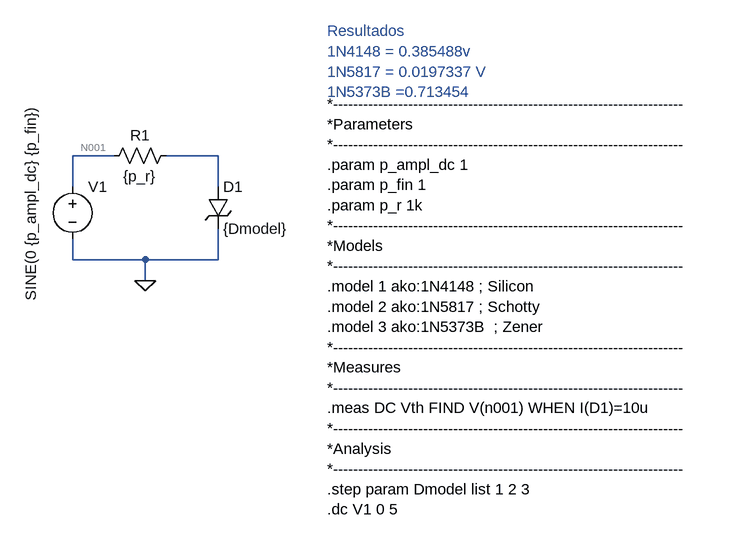
[diagram p0: schematic DIODE_DC.asc]
DIODE_DC.asc, the LTspice schematic file:
Version 4
SHEET 1 1236 680
WIRE 176 32 112 32
WIRE 336 32 256 32
WIRE 112 80 112 32
WIRE 336 80 336 32
WIRE 112 192 112 160
WIRE 224 192 112 192
WIRE 336 192 336 144
WIRE 336 192 224 192
WIRE 224 224 224 192
FLAG 224 224 0
SYMBOL voltage 112 64 R0
WINDOW 3 -64 -111 VRight 2
WINDOW 123 0 0 Left 0
WINDOW 39 0 0 Left 0
SYMATTR Value SINE(0 {p_ampl_dc} {p_fin})
SYMATTR InstName V1
SYMBOL res 272 16 R90
WINDOW 0 0 56 VBottom 2
WINDOW 3 32 56 VTop 2
SYMATTR InstName R1
SYMATTR Value {p_r}
SYMBOL zener 320 80 R0
SYMATTR InstName D1
SYMATTR Value {Dmodel}
SYMATTR Description Diode
SYMATTR Type diode
TEXT 504 -48 Left 2 !*----------------------------------------------------------------------\n*Parameters\n*----------------------------------------------------------------------\n.param p_ampl_dc 1\n.param p_fin 1\n.param p_r 1k\n*----------------------------------------------------------------------\n*Models\n*----------------------------------------------------------------------\n.model 1 ako:1N4148 ; Silicon\n.model 2 ako:1N5817 ; Schotty\n.model 3 ako:1N5373B  ; Zener\n*----------------------------------------------------------------------\n*Measures\n*----------------------------------------------------------------------\n.meas DC Vth FIND V(n001) WHEN I(D1)=10u\n*----------------------------------------------------------------------\n*Analysis\n*----------------------------------------------------------------------\n.step param Dmodel list 1 2 3\n.dc V1 0 5
TEXT 504 -160 Left 2 ;Resultados\n1N4148 = 0.385488v\n1N5817 = 0.0197337 V\n1N5373B =0.713454

The netlist it stands for:
* DIODE_DC.asc
V1 N001 0 SINE(0 {p_ampl_dc} {p_fin})
R1 N002 N001 {p_r}
D1 N002 0 {Dmodel}
.model D D
.lib standard.dio
*----------------------------------------------------------------------
*Parameters
*----------------------------------------------------------------------
.param p_ampl_dc 1
.param p_fin 1
.param p_r 1k
*----------------------------------------------------------------------
*Models
*----------------------------------------------------------------------
.model 1 ako:1N4148 ; Silicon
.model 2 ako:1N5817 ; Schotty
.model 3 ako:1N5373B  ; Zener
*----------------------------------------------------------------------
*Measures
*----------------------------------------------------------------------
.meas DC Vth FIND V(n001) WHEN I(D1)=10u
*----------------------------------------------------------------------
*Analysis
*----------------------------------------------------------------------
.step param Dmodel list 1 2 3
.dc V1 0 5
* Resultados
* 1N4148 = 0.385488v
* 1N5817 = 0.0197337 V
* 1N5373B =0.713454
.backanno
.end

* Results of the author's LTspice run, read from the files saved beside the schematic
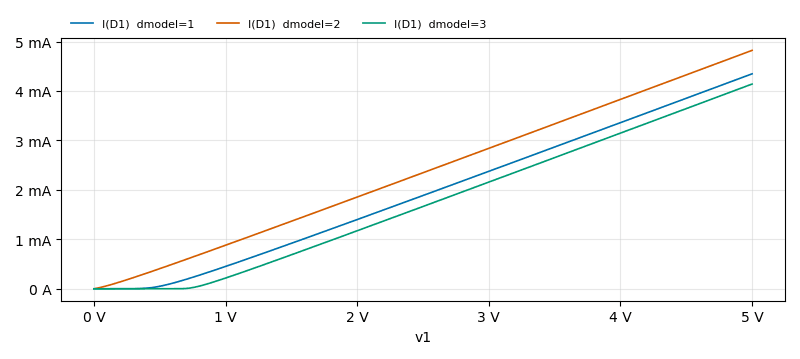
[diagram p1: DC transfer characteristic of DIODE_DC.asc, plotted from the saved traces]
* DC transfer characteristic, 3 runs:
*   I(D1) [dmodel=1]: 0 A at v1=0 V, 4.347 mA at v1=5 V, min 0 A, max 4.347 mA
*   I(D1) [dmodel=2]: 0 A at v1=0 V, 4.821 mA at v1=5 V, min 0 A, max 4.821 mA
*   I(D1) [dmodel=3]: 0 A at v1=0 V, 4.14 mA at v1=5 V, min 0 A, max 4.14 mA
* From the log:
*   Measurement: vth
*     step  v(n001)  at
*        1  0.385488  0.385488
*        2  0.0197337  0.0197337
*        3  0.713454  0.713455